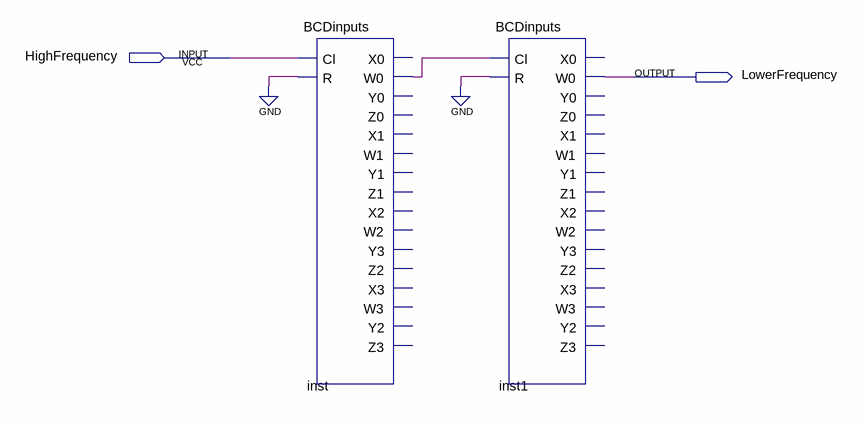
[diagram p0: schematic sheet]
// Quartus schematic FrequencyDividerHL.bdf as structural Verilog: 2 symbols, 2 pins
module FrequencyDividerHL (
  input  HighFrequency,
  output LowerFrequency
);

  wire inst_w0;

  BCDinputs inst (
    .Cl(HighFrequency), .R(1'b0), .W0(inst_w0));  // open: X0, Y0, Z0, X1, W1, Y1, Z1, X2, W2, Y3, Z2, X3, W3, Y2, Z3
  BCDinputs inst1 (
    .Cl(inst_w0), .R(1'b0), .W0(LowerFrequency));  // open: X0, Y0, Z0, X1, W1, Y1, Z1, X2, W2, Y3, Z2, X3, W3, Y2, Z3
endmodule
